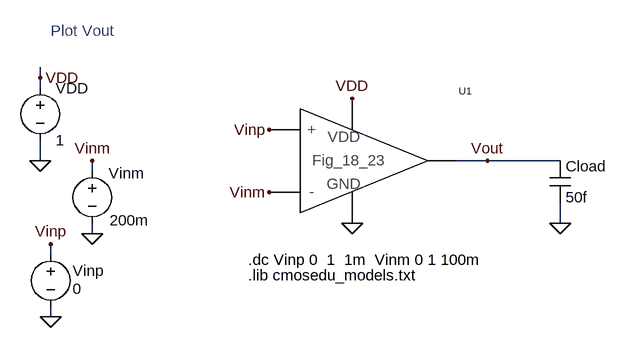
[diagram p0: schematic Fig18_24_symbol.asc]
Fig18_24_symbol.asc, the LTspice schematic file:
Version 4
SHEET 1 1496 680
WIRE 224 -544 224 -560
WIRE 224 -528 224 -544
WIRE 224 -416 224 -448
WIRE 240 -272 240 -288
WIRE 240 -176 240 -192
WIRE 304 -400 304 -416
WIRE 304 -304 304 -320
WIRE 912 -416 864 -416
WIRE 1024 -416 912 -416
WIRE 1024 -320 1024 -352
FLAG 240 -176 0
FLAG 240 -288 Vinp
FLAG 224 -416 0
FLAG 224 -544 VDD
FLAG 304 -304 0
FLAG 304 -416 Vinm
FLAG 1024 -320 0
FLAG 912 -416 Vout
FLAG 704 -512 VDD
FLAG 576 -464 Vinp
FLAG 576 -368 Vinm
FLAG 704 -320 0
SYMBOL voltage 240 -288 R0
WINDOW 0 34 41 Left 0
WINDOW 3 34 69 Left 0
WINDOW 123 0 0 Left 0
WINDOW 39 0 0 Left 0
SYMATTR InstName Vinp
SYMATTR Value 0
SYMBOL voltage 224 -544 R0
WINDOW 123 0 0 Left 0
WINDOW 39 0 0 Left 0
SYMATTR InstName VDD
SYMATTR Value 1
SYMBOL voltage 304 -416 R0
WINDOW 0 25 19 Left 0
WINDOW 3 27 91 Left 0
WINDOW 123 0 0 Left 0
WINDOW 39 0 0 Left 0
SYMATTR InstName Vinm
SYMATTR Value 200m
SYMBOL cap 1008 -416 R0
SYMATTR InstName Cload
SYMATTR Value 50f
SYMBOL Fig_18_23 624 -416 R0
SYMATTR InstName U1
TEXT 544 -264 Left 0 !.dc Vinp 0  1  1m  Vinm 0 1 100m
TEXT 544 -240 Left 0 !.lib cmosedu_models.txt
TEXT 240 -616 Left 0 ;Plot Vout

The netlist it stands for:
* Fig18_24_symbol.asc
Vinp Vinp 0 0
VDD VDD 0 1
Vinm Vinm 0 200m
Cload Vout 0 50f
XU1 Vinp Vinm Vout VDD 0 Fig_18_23  ; pins Vinp Vinm Out VDD GND
.dc Vinp 0  1  1m  Vinm 0 1 100m
.lib cmosedu_models.txt
* Plot Vout
.backanno
.end